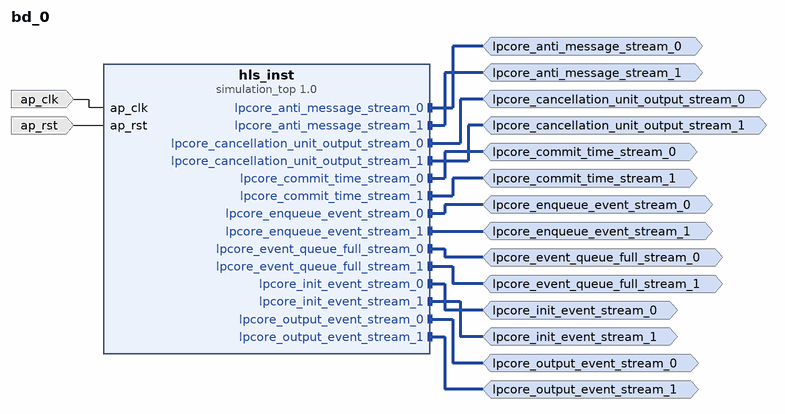
[diagram p0: block diagram of the top level]
# Vivado block design bd_0, xczu7ev-ffvc1156-2-e, Vivado 2022.1
create_bd_design bd_0

create_bd_intf_port -mode Master -vlnv xilinx.com:interface:acc_fifo_read_rtl:1.0 lpcore_anti_message_stream_0
create_bd_intf_port -mode Master -vlnv xilinx.com:interface:acc_fifo_read_rtl:1.0 lpcore_anti_message_stream_1
create_bd_intf_port -mode Master -vlnv xilinx.com:interface:acc_fifo_write_rtl:1.0 lpcore_cancellation_unit_output_stream_0
create_bd_intf_port -mode Master -vlnv xilinx.com:interface:acc_fifo_write_rtl:1.0 lpcore_cancellation_unit_output_stream_1
create_bd_intf_port -mode Master -vlnv xilinx.com:interface:acc_fifo_read_rtl:1.0 lpcore_commit_time_stream_0
create_bd_intf_port -mode Master -vlnv xilinx.com:interface:acc_fifo_read_rtl:1.0 lpcore_commit_time_stream_1
create_bd_intf_port -mode Master -vlnv xilinx.com:interface:acc_fifo_read_rtl:1.0 lpcore_enqueue_event_stream_0
create_bd_intf_port -mode Master -vlnv xilinx.com:interface:acc_fifo_read_rtl:1.0 lpcore_enqueue_event_stream_1
create_bd_intf_port -mode Master -vlnv xilinx.com:interface:acc_fifo_write_rtl:1.0 lpcore_event_queue_full_stream_0
create_bd_intf_port -mode Master -vlnv xilinx.com:interface:acc_fifo_write_rtl:1.0 lpcore_event_queue_full_stream_1
create_bd_intf_port -mode Master -vlnv xilinx.com:interface:acc_fifo_read_rtl:1.0 lpcore_init_event_stream_0
create_bd_intf_port -mode Master -vlnv xilinx.com:interface:acc_fifo_read_rtl:1.0 lpcore_init_event_stream_1
create_bd_intf_port -mode Master -vlnv xilinx.com:interface:acc_fifo_write_rtl:1.0 lpcore_output_event_stream_0
create_bd_intf_port -mode Master -vlnv xilinx.com:interface:acc_fifo_write_rtl:1.0 lpcore_output_event_stream_1
create_bd_port -dir I -type clk ap_clk
set_property -dict {CONFIG.FREQ_HZ 200000000.0} [get_bd_ports ap_clk]
create_bd_port -dir I -type rst ap_rst
set_property -dict {CONFIG.POLARITY ACTIVE_HIGH} [get_bd_ports ap_rst]

create_bd_cell -type ip -vlnv xilinx.com:hls:simulation_top:1.0 hls_inst

# ---- connections ----

connect_bd_intf_net [get_bd_intf_ports lpcore_anti_message_stream_0] [get_bd_intf_pins hls_inst/lpcore_anti_message_stream_0]
connect_bd_intf_net [get_bd_intf_ports lpcore_anti_message_stream_1] [get_bd_intf_pins hls_inst/lpcore_anti_message_stream_1]
connect_bd_intf_net [get_bd_intf_ports lpcore_cancellation_unit_output_stream_0] [get_bd_intf_pins hls_inst/lpcore_cancellation_unit_output_stream_0]
connect_bd_intf_net [get_bd_intf_ports lpcore_cancellation_unit_output_stream_1] [get_bd_intf_pins hls_inst/lpcore_cancellation_unit_output_stream_1]
connect_bd_intf_net [get_bd_intf_ports lpcore_commit_time_stream_0] [get_bd_intf_pins hls_inst/lpcore_commit_time_stream_0]
connect_bd_intf_net [get_bd_intf_ports lpcore_commit_time_stream_1] [get_bd_intf_pins hls_inst/lpcore_commit_time_stream_1]
connect_bd_intf_net [get_bd_intf_ports lpcore_enqueue_event_stream_0] [get_bd_intf_pins hls_inst/lpcore_enqueue_event_stream_0]
connect_bd_intf_net [get_bd_intf_ports lpcore_enqueue_event_stream_1] [get_bd_intf_pins hls_inst/lpcore_enqueue_event_stream_1]
connect_bd_intf_net [get_bd_intf_ports lpcore_event_queue_full_stream_0] [get_bd_intf_pins hls_inst/lpcore_event_queue_full_stream_0]
connect_bd_intf_net [get_bd_intf_ports lpcore_event_queue_full_stream_1] [get_bd_intf_pins hls_inst/lpcore_event_queue_full_stream_1]
connect_bd_intf_net [get_bd_intf_ports lpcore_init_event_stream_0] [get_bd_intf_pins hls_inst/lpcore_init_event_stream_0]
connect_bd_intf_net [get_bd_intf_ports lpcore_init_event_stream_1] [get_bd_intf_pins hls_inst/lpcore_init_event_stream_1]
connect_bd_intf_net [get_bd_intf_ports lpcore_output_event_stream_0] [get_bd_intf_pins hls_inst/lpcore_output_event_stream_0]
connect_bd_intf_net [get_bd_intf_ports lpcore_output_event_stream_1] [get_bd_intf_pins hls_inst/lpcore_output_event_stream_1]
connect_bd_net -net ap_clk_0_1 [get_bd_ports ap_clk] [get_bd_pins hls_inst/ap_clk]
connect_bd_net -net ap_rst_0_1 [get_bd_ports ap_rst] [get_bd_pins hls_inst/ap_rst]

validate_bd_design
save_bd_design
